# EAGLE design BoardSchematics (EAGLE 9.2.0)

## Sheet 1 of 2: I/O Config
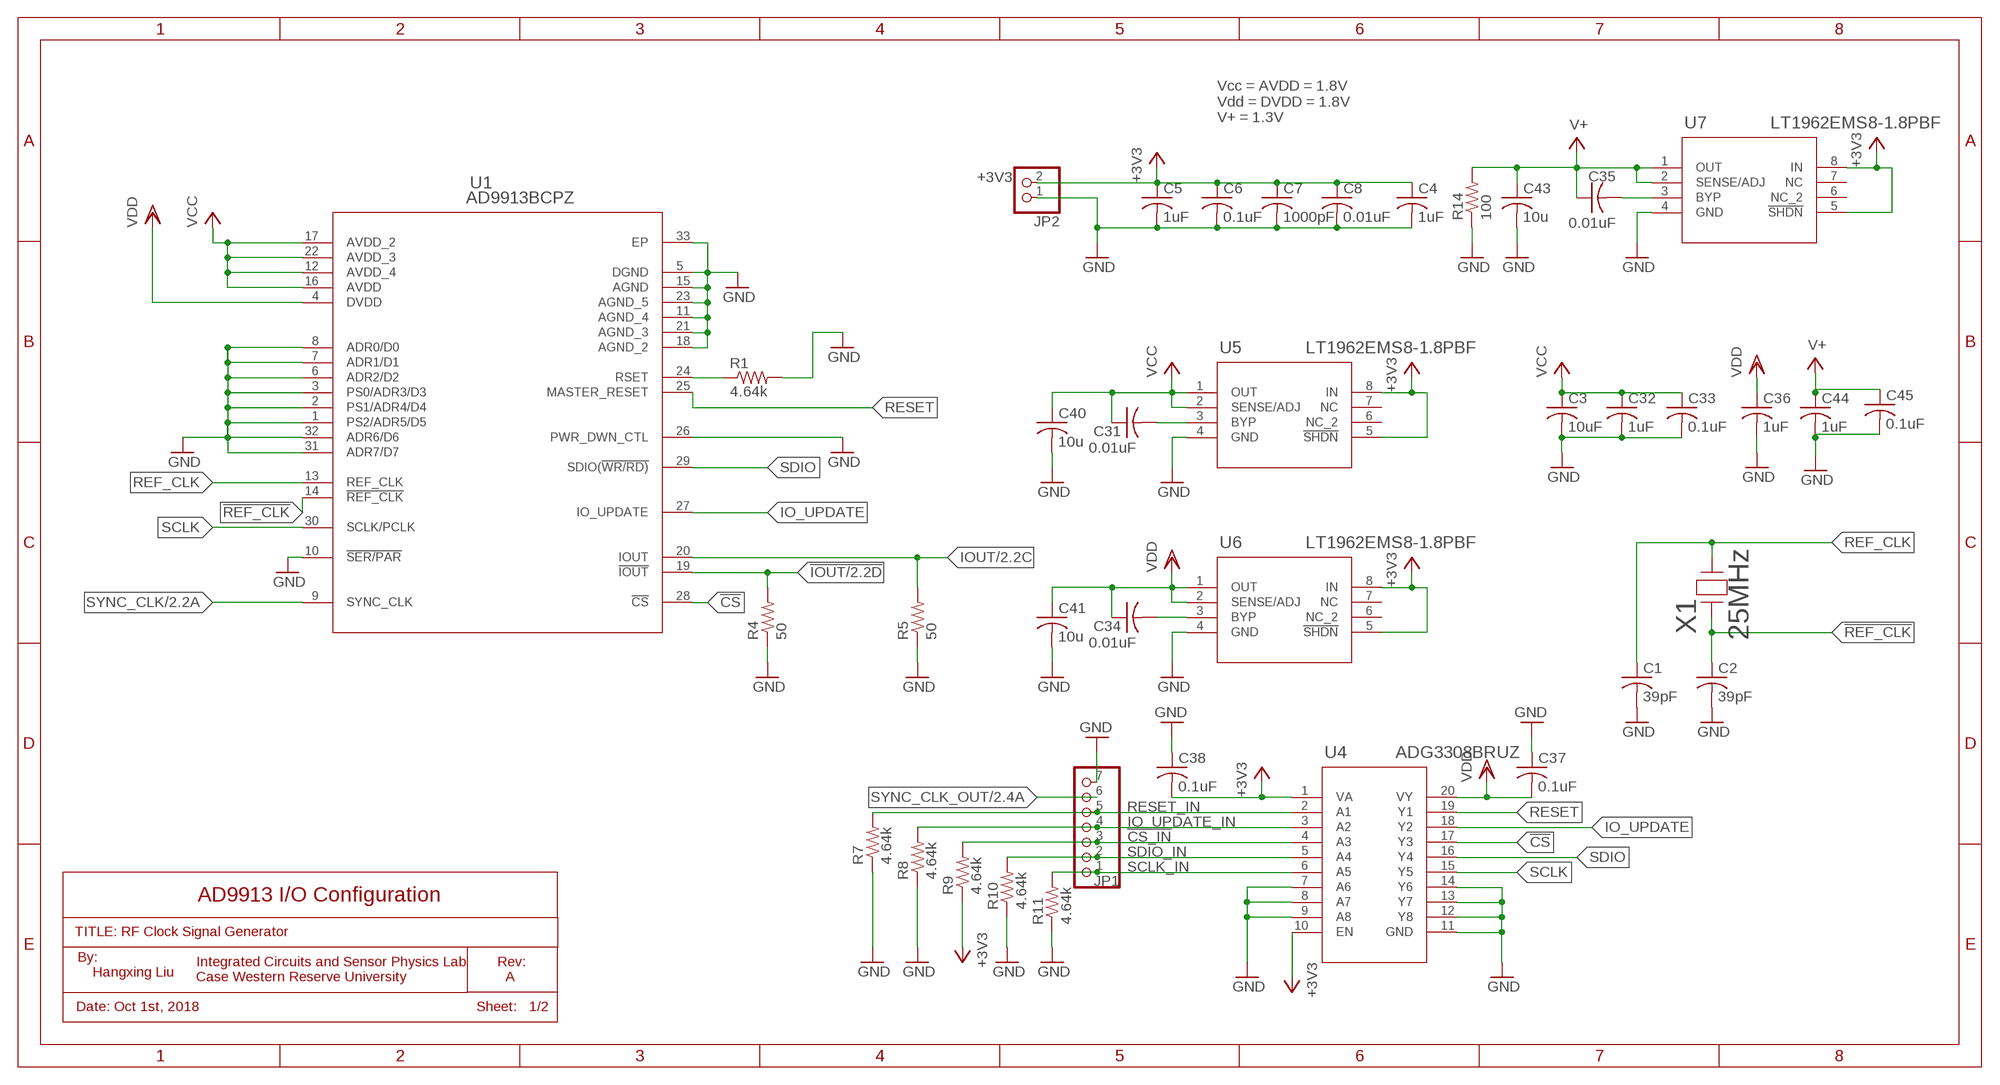
[diagram p0: schematic, sheet 1]

### Parts
C1  39pF  C-USC1608  [C1608]
C2  39pF  C-USC1608  [C1608]
C3  10uF  C-USC0603K  [C0603K]
C4  1uF  C-USC0603K  [C0603K]
C5  1uF  C-USC0603K  [C0603K]
C6  0.1uF  C-USC0603K  [C0603K]
C7  1000pF  C-USC0603K  [C0603K]
C8  0.01uF  C-USC0603K  [C0603K]
C31  0.01uF  C-USC0603K  [C0603K]
C32  1uF  C-USC0603K  [C0603K]
C33  0.1uF  C-USC0603K  [C0603K]
C34  0.01uF  C-USC0603K  [C0603K]
C35  0.01uF  C-USC0603K  [C0603K]
C36  1uF  C-USC0603K  [C0603K]
C37  0.1uF  C-USC0603K  [C0603K]
C38  0.1uF  C-USC0603K  [C0603K]
C40  10u  C-USC0603K  [C0603K]
C41  10u  C-USC0603K  [C0603K]
C43  10u  C-USC0603K  [C0603K]
C44  1uF  C-USC0603K  [C0603K]
C45  0.1uF  C-USC0603K  [C0603K]
JP1  PINHD-1X7  [1X07]
JP2  PINHD-1X2  [1X02]
R1  4.64k  R-US_R0603  [R0603]
R4  50  R-US_R0603  [R0603]
R5  50  R-US_R0603  [R0603]
R7  4.64k  R-US_R0603  [R0603]
R8  4.64k  R-US_R0603  [R0603]
R9  4.64k  R-US_R0603  [R0603]
R10  4.64k  R-US_R0603  [R0603]
R11  4.64k  R-US_R0603  [R0603]
R14  100  R-US_R0603  [R0603]
U1  AD9913BCPZ  [CP_32_2]
U4  ADG3308BRUZ  [RU_20]
U5  LT1962EMS8-1.8PBF  [MSOP-8_MS]
U6  LT1962EMS8-1.8PBF  [MSOP-8_MS]
U7  LT1962EMS8-1.8PBF  [MSOP-8_MS]
X1  25MHz  FOXSDLF/250F-20  [CRYSTAL_HC49SDLF]

### Nets
!CS: U1.28(!CS) U4.17(Y3)
!CS_IN: JP1.3 R9.2 U4.4(A3)
!IOUT: R4.2 U1.19(!IOUT) ; also sheet 2
!REF_CLK: C2.1 U1.14(!REF_CLK) X1.1
+3V3: C4.1 C5.1 C6.1 C7.1 C8.1 C38.2 JP2.2 R9.1 U4.1(VA) U4.10(EN) U5.5(!SHDN) U5.8(IN) U6.5(!SHDN) U6.8(IN) U7.5(!SHDN) U7.8(IN) ; also sheet 2
GND: C1.2 C2.2 C3.2 C4.2 C5.2 C6.2 C7.2 C8.2 C32.2 C33.2 C36.2 C37.1 C38.1 C40.2 C41.2 C43.2 C44.2 C45.2 JP1.7 JP2.1 R1.2 R4.1 R5.1 R7.1 R8.1 R10.1 R11.1 R14.1 U1.1(PS2/ADR5/D5) U1.2(PS1/ADR4/D4) U1.3(PS0/ADR3/D3) U1.5(DGND) U1.6(ADR2/D2) U1.7(ADR1/D1) U1.8(ADR0/D0) U1.10(!SER/PAR) U1.11(AGND_4) U1.15(AGND) U1.18(AGND_2) U1.21(AGND_3) U1.23(AGND_5) U1.26(PWR_DWN_CTL) U1.31(ADR7/D7) U1.32(ADR6/D6) U1.33(EP) U4.7(A6) U4.8(A7) U4.9(A8) U4.11(GND) U4.12(Y8) U4.13(Y7) U4.14(Y6) U5.4(GND) U6.4(GND) U7.4(GND) ; also sheet 2
IO_UPDATE: U1.27(IO_UPDATE) U4.18(Y2)
IO_UPDATE_IN: JP1.4 R8.2 U4.3(A2)
IOUT: R5.2 U1.20(IOUT) ; also sheet 2
N$1: R1.1 U1.24(RSET)
N$4: C31.2 U5.3(BYP)
N$7: C34.2 U6.3(BYP)
N$8: C35.2 U7.3(BYP)
REF_CLK: C1.1 U1.13(REF_CLK) X1.2
RESET: U1.25(MASTER_RESET) U4.19(Y1)
RESET_IN: JP1.5 R7.2 U4.2(A1)
SCLK: U1.30(SCLK/PCLK) U4.15(Y5)
SCLK_IN: JP1.1 R11.2 U4.6(A5)
SDIO: U1.29(SDIO(!WR/RD)) U4.16(Y4)
SDIO_IN: JP1.2 R10.2 U4.5(A4)
SYNC_CLK: U1.9(SYNC_CLK) ; also sheet 2
SYNC_CLK_OUT: JP1.6 ; also sheet 2
V+: C35.1 C43.1 C44.1 C45.1 R14.2 U7.1(OUT) U7.2(SENSE/ADJ) ; also sheet 2
VCC: C3.1 C31.1 C32.1 C33.1 C40.1 U1.12(AVDD_4) U1.16(AVDD) U1.17(AVDD_2) U1.22(AVDD_3) U5.1(OUT) U5.2(SENSE/ADJ)
VDD: C34.1 C36.1 C37.2 C41.1 U1.4(DVDD) U4.20(VY) U6.1(OUT) U6.2(SENSE/ADJ)
Unconnected: U5.6(NC_2) U5.7(NC) U6.6(NC_2) U6.7(NC) U7.6(NC_2) U7.7(NC)

### Notes on the sheet
- Vcc = AVDD = 1.8V
  Vdd = DVDD = 1.8V
  V+ = 1.3V
- AD9913 I/O Configuration
- TITLE: RF Clock Signal Generator
- By:
- Hangxing Liu
- Integrated Circuits and Sensor Physics Lab
  Case Western Reserve University
- Rev:
    A
- Date: Oct 1st, 2018 | Sheet:   1/2

## Sheet 2 of 2: Filter, Buffer and Comparator
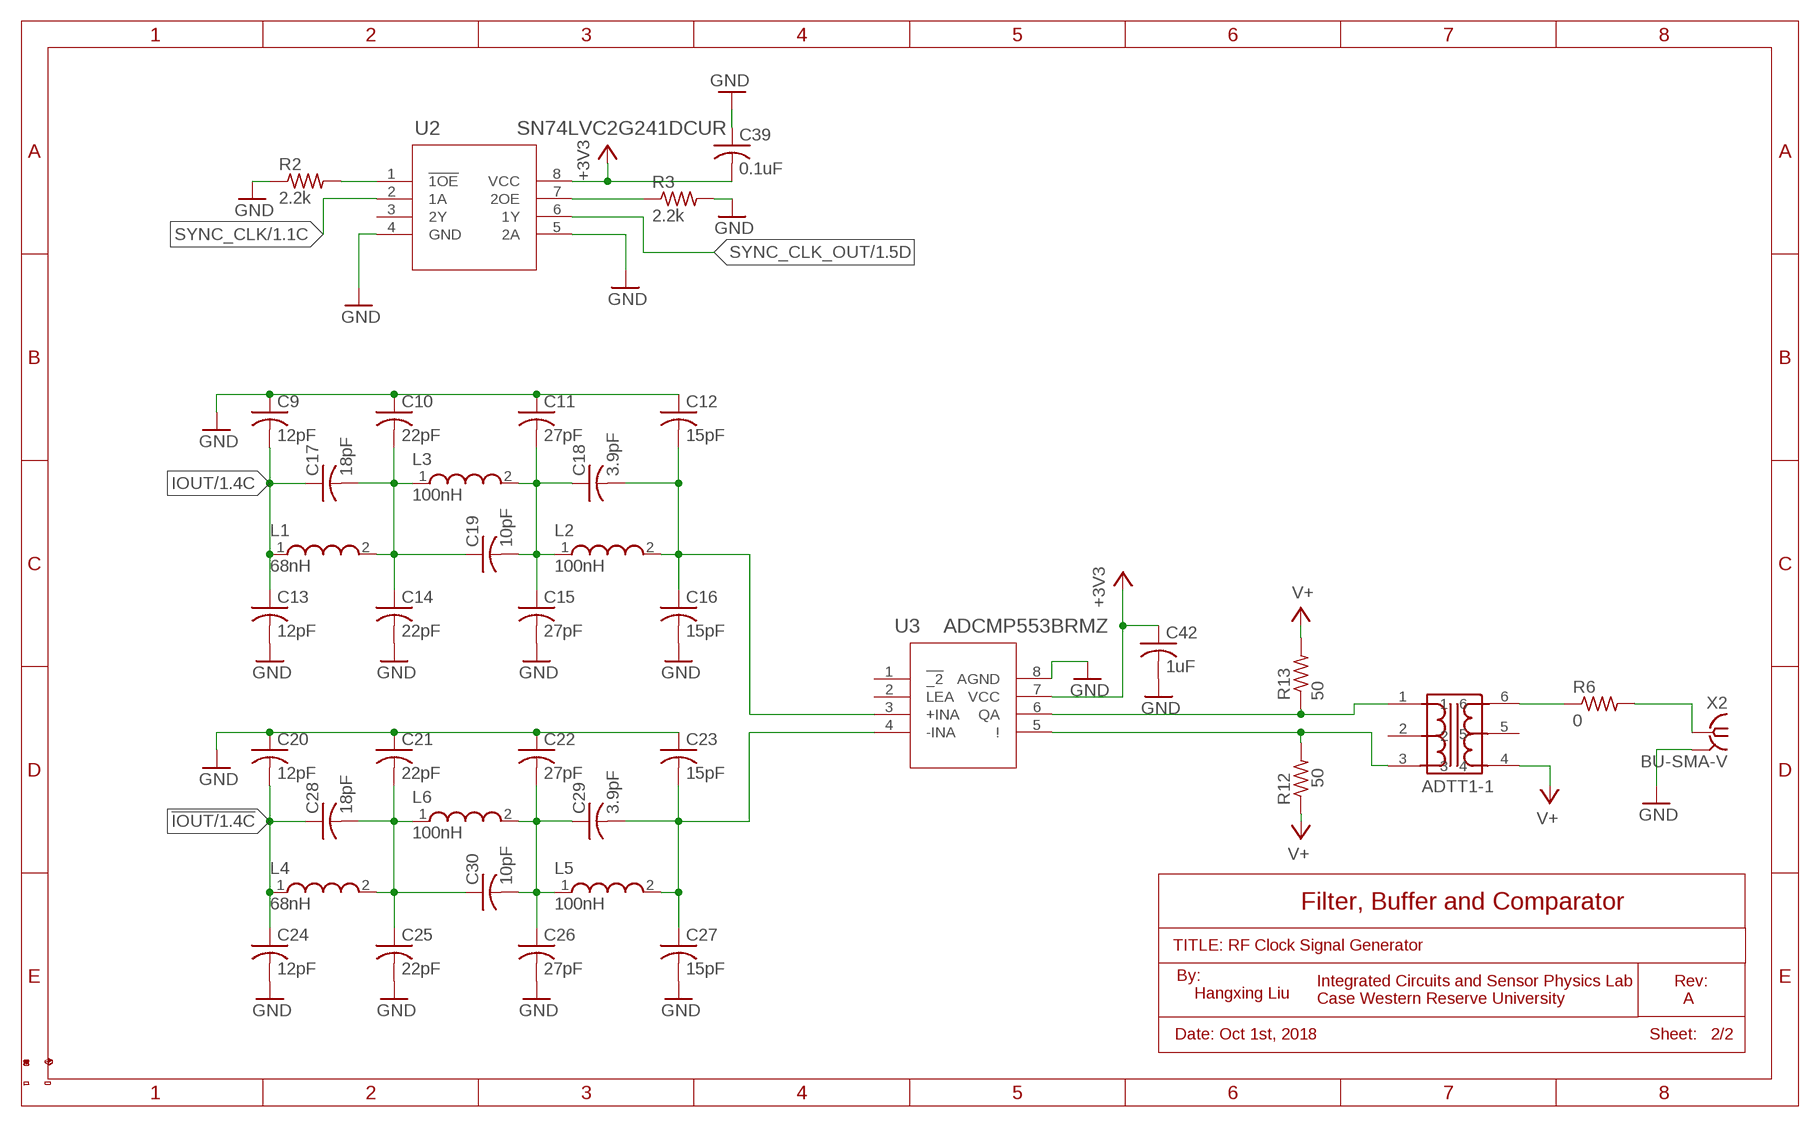
[diagram p1: schematic, sheet 2]

### Parts
ATT1-1  PWB-1-CLCD542  [CD542]
C9  12pF  C-USC0603K  [C0603K]
C10  22pF  C-USC0603K  [C0603K]
C11  27pF  C-USC0603K  [C0603K]
C12  15pF  C-USC0603K  [C0603K]
C13  12pF  C-USC0603K  [C0603K]
C14  22pF  C-USC0603K  [C0603K]
C15  27pF  C-USC0603K  [C0603K]
C16  15pF  C-USC0603K  [C0603K]
C17  18pF  C-USC0603K  [C0603K]
C18  3.9pF  C-USC0603K  [C0603K]
C19  10pF  C-USC0603K  [C0603K]
C20  12pF  C-USC0603K  [C0603K]
C21  22pF  C-USC0603K  [C0603K]
C22  27pF  C-USC0603K  [C0603K]
C23  15pF  C-USC0603K  [C0603K]
C24  12pF  C-USC0603K  [C0603K]
C25  22pF  C-USC0603K  [C0603K]
C26  27pF  C-USC0603K  [C0603K]
C27  15pF  C-USC0603K  [C0603K]
C28  18pF  C-USC0603K  [C0603K]
C29  3.9pF  C-USC0603K  [C0603K]
C30  10pF  C-USC0603K  [C0603K]
C39  0.1uF  C-USC0603K  [C0603K]
C42  1uF  C-USC0603K  [C0603K]
L1  68nH  WE-PMI_1008  [WE-PMI_1008]
L2  100nH  WE-PMI_1008  [WE-PMI_1008]
L3  100nH  WE-PMI_1008  [WE-PMI_1008]
L4  68nH  WE-PMI_1008  [WE-PMI_1008]
L5  100nH  WE-PMI_1008  [WE-PMI_1008]
L6  100nH  WE-PMI_1008  [WE-PMI_1008]
R2  2.2k  R-US_R0603  [R0603]
R3  2.2k  R-US_R0603  [R0603]
R6  0  R-US_R0603  [R0603]
R12  50  R-US_R0603  [R0603]
R13  50  R-US_R0603  [R0603]
U2  SN74LVC2G241DCUR  [DCU8]
U3  ADCMP553BRMZ  [RM_8]
X2  BU-SMA-V  [BU-SMA-V]

### Nets
!IOUT: C20.2 C24.1 C28.1 L4.1 ; also sheet 1
+3V3: C39.2 C42.1 U2.8(VCC) U3.7(VCC) ; also sheet 1
GND: C9.1 C10.1 C11.1 C12.1 C13.2 C14.2 C15.2 C16.2 C20.1 C21.1 C22.1 C23.1 C24.2 C25.2 C26.2 C27.2 C39.1 C42.2 R2.1 R3.2 U2.4(GND) U2.5(2A) U3.8(AGND) X2.2 X2.3 X2.4 X2.5 ; also sheet 1
IOUT: C9.2 C13.1 C17.1 L1.1 ; also sheet 1
N$2: ATT1-1.1 R13.1 U3.6(QA)
N$3: ATT1-1.3 R12.2 U3.5(!)
N$5: ATT1-1.6 R6.1
N$6: R6.2 X2.1
N$9: R2.2 U2.1(!1OE)
N$10: C21.2 C25.1 C28.2 C30.1 L4.2 L6.1
N$11: C10.2 C14.1 C17.2 C19.1 L1.2 L3.1
N$12: R3.1 U2.7(2OE)
N$13: C11.2 C15.1 C18.1 C19.2 L2.1 L3.2
N$14: C12.2 C16.1 C18.2 L2.2 U3.3(+INA)
N$15: C22.2 C26.1 C29.1 C30.2 L5.1 L6.2
N$16: C23.2 C27.1 C29.2 L5.2 U3.4(-INA)
SYNC_CLK: U2.2(1A) ; also sheet 1
SYNC_CLK_OUT: U2.6(1Y) ; also sheet 1
V+: ATT1-1.4 R12.1 R13.2 ; also sheet 1
Unconnected: ATT1-1.2 ATT1-1.5 U2.3(2Y) U3.1(!_2) U3.2(LEA)

### Notes on the sheet
- ADTT1-1
- Filter, Buffer and Comparator
- TITLE: RF Clock Signal Generator
- By:
- Hangxing Liu
- Integrated Circuits and Sensor Physics Lab
  Case Western Reserve University
- Rev:
    A
- Date: Oct 1st, 2018 | Sheet:   2/2

## Library data of the parts
ATT1-1 = untitled:PWB-1-CL
C1-C45 = resistor:C-US: CAPACITOR, American symbol
JP1 = pinhead:PINHD-1X7: PIN HEADER
JP2 = pinhead:PINHD-1X2: PIN HEADER
L1-L6 = Wurth_Elektronik_Passive_rev15c:WE-PMI: Power Multilayer Inductor Characteristics Compact multilayer type Suitable for applications with high currents up to 2.7 A Smallest RDC-Values starting at 40 mΩ Magnetically shielded construction: No crosstalk Operating temperature: –40 °C to +125 °C Available in four sizes and three different types (Low Profile, Low RDC & High Saturation Current) Recommended soldering profile: Reflow Applications DC/DC converters especially at high switching frequencies > 1 MHz Electronic devices with very low profile Portable devices like Smart Phones, Tablets, Notebooks and Digital Cameras <http://katalog.we-online.de/media/images/eisos/IndPMI_pf2.jpgg> Details see: http://katalog.we-online.de/en/pbs/WE-PMI? Updated by Dan Xu 2014-07-08 2014 (C) Wurth Elektronik
R1-R14 = resistor:R-US_: RESISTOR, American symbol
U1 = AD9913Model:AD9913BCPZ; MANUFACTURER_PART_NUMBER: AD9913BCPZ; VENDOR: Analog Devices Inc
U2 = Buffer:SN74LVC2G241DCUR; MANUFACTURER_PART_NUMBER: SN74LVC2G241DCUR; VENDOR: Texas Instruments
U3 = COMP:ADCMP553BRMZ; MANUFACTURER_PART_NUMBER: ADCMP553BRMZ; VENDOR: Analog Devices Inc
U4 = 3308:ADG3308BRUZ; MANUFACTURER_PART_NUMBER: ADG3308BRUZ; VENDOR: Analog Devices Inc
U5-U7 = 1962:LT1962EMS8-1.8PBF; MANUFACTURER_PART_NUMBER: LT1962EMS81.8#PBF; VENDOR: Linear Technology
X1 = OscillatorModel:FOXSDLF/250F-20; MANUFACTURER_PART_NUMBER: FOXSDLF250F20; VENDOR: Fox
X2 = con-coax:BU-SMA-V: FEMALE SMA CONNECTOR Radiall distributor RS 112-3794; OC_FARNELL: unknown; OC_NEWARK: unknown

## Board
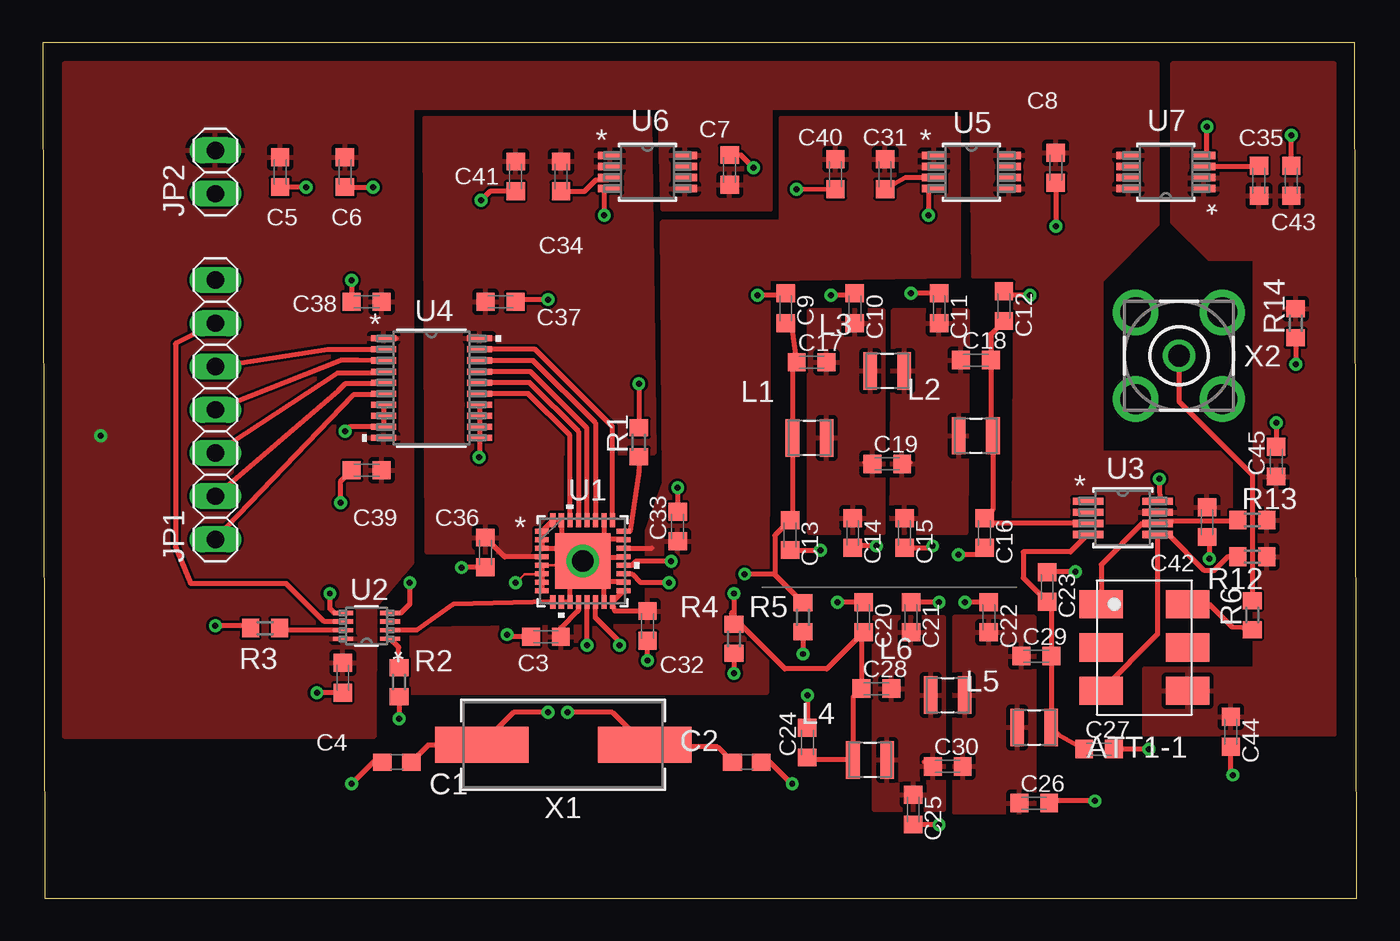
[diagram p2: board, top side]
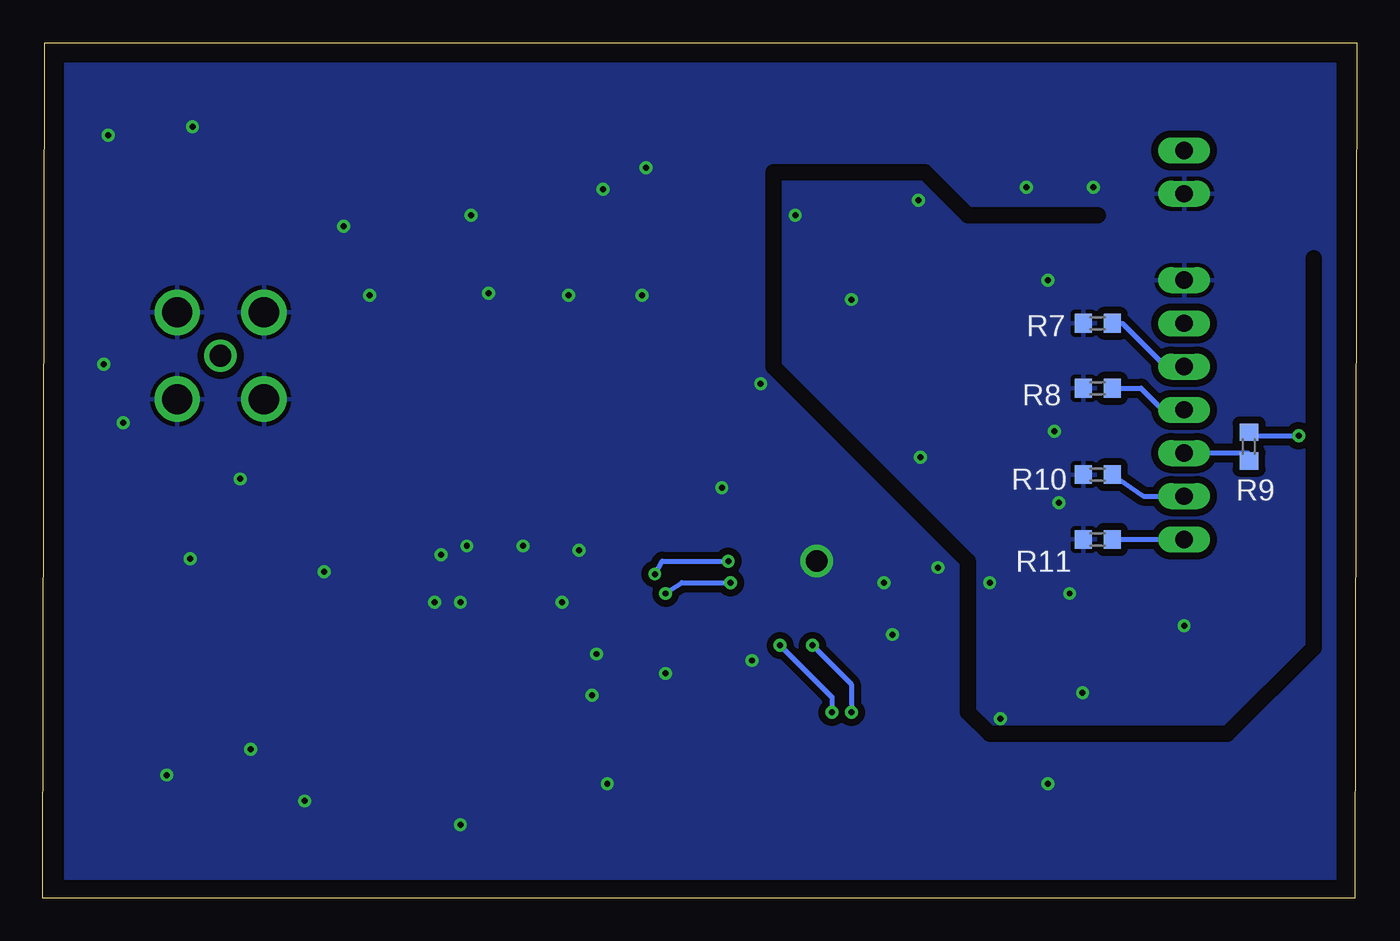
[diagram p3: board, bottom side, seen from below]

Size 77.27 x 50.28 mm. Coordinates in mm from the lower left corner, seen from the top.
Outline: 0.13,0 77.27,0 77.14,50.28 0,50.28 0.13,0
Copper layers (1*16): Top 0.035mm / dielectric 1.5mm / Bottom 0.035mm
Design rules "default": minimum track width 6mil, minimum drill 0.35mm, track to track 6mil, track to pad 6mil, pad to pad 6mil, via to via 6mil, smd to smd 6mil, copper to edge 40mil, drill to drill 6mil, minimum pad ring 10mil, minimum via ring 8mil, stop-mask expansion 4mil, vias tented up to drill 0mil, thermal gap 10mil
bRestrict: 10 lines

### Footprints (pad centres in the part's own frame; a part is rotated, then mirrored left to right if it is on the bottom)
CD542 = smd 1.651 x 2.54: 1 -2.54,-2.54; 2 0,-2.54; 3 2.54,-2.54; 4 2.54,2.54; 5 0,2.54; 6 -2.54,2.54
C1608 = smd 1.1 x 1: 1 -0.85,0; 2 0.85,0
C0603K = smd 1.05 x 1.08: 1 -0.875,0; 2 0.875,0
1X07 = drill 1.016 long: 1 -7.62,0; 2 -5.08,0; 3 -2.54,0; 4 0,0; 5 2.54,0; 6 5.08,0; 7 7.62,0
1X02 = drill 1.016 long: 1 -1.27,0; 2 1.27,0
WE-PMI_1008 = smd 0.8 x 2.2: 1 -1,0; 2 1,0
R0603 = smd 1 x 1.1: 1 -0.85,0; 2 0.85,0
CP_32_2 = smd 0.813 x 0.305: 1 -2.4,1.75; 2 -2.4,1.25; 3 -2.4,0.75; 4 -2.4,0.25; 5 -2.4,-0.25; 6 -2.4,-0.75; 7 -2.4,-1.25; 8 -2.4,-1.75; 17 2.4,-1.75; 18 2.4,-1.25; 19 2.4,-0.75; 20 2.4,-0.25; 21 2.4,0.25; 22 2.4,0.75; 23 2.4,1.25; 24 2.4,1.75 | smd 0.305 x 0.813: 9 -1.75,-2.4; 10 -1.25,-2.4; 11 -0.75,-2.4; 12 -0.25,-2.4; 13 0.25,-2.4; 14 0.75,-2.4; 15 1.25,-2.4; 16 1.75,-2.4; 25 1.75,2.4; 26 1.25,2.4; 27 0.75,2.4; 28 0.25,2.4; 29 -0.25,2.4; 30 -0.75,2.4; 31 -1.25,2.4; 32 -1.75,2.4 | smd 3.251 x 3.251: 33 0,0
DCU8 = smd 1.168 x 0.254: 1 -1.372,0.75; 2 -1.372,0.25; 3 -1.372,-0.25; 4 -1.372,-0.75; 5 1.372,-0.75; 6 1.372,-0.25; 7 1.372,0.25; 8 1.372,0.75
RM_8 = smd 1.778 x 0.432: 1 -2.045,0.975; 2 -2.045,0.325; 3 -2.045,-0.325; 4 -2.045,-0.975; 5 2.045,-0.975; 6 2.045,-0.325; 7 2.045,0.325; 8 2.045,0.975
RU_20 = smd 1.473 x 0.356: 1 -2.819,2.925; 2 -2.819,2.275; 3 -2.819,1.625; 4 -2.819,0.975; 5 -2.819,0.325; 6 -2.819,-0.325; 7 -2.819,-0.975; 8 -2.819,-1.625; 9 -2.819,-2.275; 10 -2.819,-2.925; 11 2.819,-2.925; 12 2.819,-2.275; 13 2.819,-1.625; 14 2.819,-0.975; 15 2.819,-0.325; 16 2.819,0.325; 17 2.819,0.975; 18 2.819,1.625; 19 2.819,2.275; 20 2.819,2.925
MSOP-8_MS = smd 1.397 x 0.432: 1 -2.21,0.975; 2 -2.21,0.325; 3 -2.21,-0.325; 4 -2.21,-0.975; 5 2.21,-0.975; 6 2.21,-0.325; 7 2.21,0.325; 8 2.21,0.975
CRYSTAL_HC49SDLF = smd 5.499 x 2.108: 1 -4.794,0; 2 4.794,0
BU-SMA-V = drill 1.27: 1 0,0 | drill 1.778: 2 -2.55,2.55; 3 2.55,2.55; 4 2.55,-2.55; 5 -2.55,-2.55

### Placement (x,y rotation side)
ATT1-1  64.77,14.73 270 top
C1  20.83,8 180 top
C2  41.4,8 0 top
C3  29.59,15.37 180 top
C4  17.65,12.95 270 top
C5  13.97,42.67 270 top
C6  17.78,42.67 270 top
C7  40.39,42.8 90 top
C8  59.56,42.93 270 top
C9  43.69,34.67 270 top
C10  47.75,34.67 270 top
C11  52.7,34.67 270 top
C12  56.52,34.8 270 top
C13  43.94,21.34 270 top
C14  47.62,21.46 270 top
C15  50.67,21.46 270 top
C16  55.37,21.46 270 top
C17  45.21,31.5 0 top
C18  54.86,31.62 0 top
C19  49.66,25.53 0 top
C20  48.26,16.51 270 top
C21  51.05,16.51 270 top
C22  55.63,16.51 270 top
C23  59.05,18.29 270 top
C24  44.96,9.14 90 top
C25  51.18,5.21 270 top
C26  58.29,5.59 0 top
C27  62.1,8.76 0 top
C28  49.02,12.32 0 top
C29  58.42,14.22 0 top
C30  53.21,7.75 0 top
C31  49.53,42.55 270 top
C32  35.56,16 270 top
C33  37.34,21.84 90 top
C34  30.48,42.42 270 top
C35  71.5,42.16 90 top
C36  26.03,20.32 270 top
C37  26.92,35.05 180 top
C38  19.05,35.05 0 top
C39  19.05,25.15 0 top
C40  46.61,42.55 270 top
C41  27.81,42.42 270 top
C42  68.45,22.1 270 top
C43  73.41,42.16 90 top
C44  69.85,9.78 270 top
C45  72.52,25.65 90 top
JP1  10.16,28.7 90 top
JP2  10.16,42.67 90 top
L1  45.09,27.05 0 top
L2  54.86,27.18 0 top
L3  49.66,30.99 0 top
L4  48.64,8.13 0 top
L5  58.29,10.03 0 top
L6  53.21,11.94 0 top
R1  35.05,26.8 90 top
R2  20.95,12.7 90 top
R3  13.08,15.88 180 top
R4  40.64,15.24 90 top
R5  44.7,16.51 90 top
R6  71.12,16.64 90 top
R7  15.24,33.78 0 bottom
R8  15.24,29.97 0 bottom
R9  6.35,26.54 270 bottom
R10  15.24,24.89 0 bottom
R11  15.24,21.08 0 bottom
R12  71.12,20.07 180 top
R13  71.12,22.23 0 top
R14  73.66,33.78 90 top
U1  31.75,19.81 0 top
U2  19.05,16 180 top
U3  63.5,22.35 0 top
U4  22.86,29.97 0 top
U5  54.61,42.67 0 top
U6  35.56,42.67 0 top
U7  66.04,42.67 180 top
X1  30.61,9.02 180 top
X2  66.8,31.88 0 top

### Tracks (layer width: path | path; a pad name or v marks a point on that pad's centre or on a via)
!CS
  Top 0.305: U1.28 32,27.62 28.68,30.95 U4.17
!CS_IN
  Top 0.305: JP1.3 17.33,30.86 19.95,30.86 U4.4
  Bottom 0.305: JP1.3 6.39,26.16 R9.2
!IOUT  (via drill 0.35)
  Top 0.305: R4.2 40.5,16.78 | v40.64,17.91 R4.2 | v36.83,18.54 35.16,18.54 34.64,19.06 U1.19 | C24.1 45.1,8.13 L4.1 47.64,11.81 C28.1 48.15,15.63 C20.2 46.1,13.48 43.63,13.48 41.02,16.09 R4.2
  Bottom 0.305: v40.64,17.91 39.69,18.54 v36.83,18.54
!REF_CLK  (via drill 0.35)
  Top 0.305: v33.91,14.86 33.91,15.06 32.5,16.47 U1.14 | v30.86,10.92 33.5,10.92 X1.1 36.67,9.02 36.8,8.89 39.66,8.89 C2.1
  Bottom 0.305: v33.91,14.86 30.86,11.81 v30.86,10.92
+3V3  (via drill 0.35)
  Top 0.305: 20.8,32.9 U4.1 | U5.8 | U5.5 56.86,41.7
  Bottom 0.305: R9.1 6.13,27.18 v3.43,27.18
  pour Top: 1.27,49.02 1.27,9.52 19.51,9.52 19.56,17.15 21.72,19.72 21.72,46.48 36.32,46.48 36.32,44.7 36.45,40.51 42.8,40.51 42.8,46.48 54.61,46.48 54.71,36.58 57.2,36.58 57.1,22.14 65.53,22.14 69.85,22.1 69.85,26.16 62.23,26.16 62.23,36.32 65.53,39.62 65.53,49.02
GND  (via drill 0.35, 1.27 pad 1.78)
  Top 0.152: U1.6 29.34,19.05 28.32,19.05 v27.81,18.54 | U1.5 31.5,19.56
  Top 0.305: U1.1 U1.2 | U1.1 U1.3 | v65.02,8.76 C27.2 | v61.85,5.72 59.3,5.72 C26.2 | v52.7,4.32 51.2,4.32 C25.2 | v44.96,11.94 C24.2 | v60.71,19.18 59.07,19.18 C23.1 | C22.1 54.24,17.38 v54.23,17.4 | v52.7,17.4 51.07,17.4 C21.1 | C20.1 46.75,17.38 v46.74,17.4 | C16.2 54.98,20.19 v53.85,20.19 | v52.32,20.7 52.21,20.59 C15.2 | v49.02,20.7 47.74,20.7 C14.2 | v45.72,20.45 45.71,20.46 C13.2 | v58.04,35.43 56.75,35.43 C12.1 | C11.1 52.69,35.56 v51.05,35.56 | C10.1 47.64,35.43 v46.35,35.43 | C9.1 43.58,35.43 v42.04,35.43 | R2.1 v20.95,10.54 | v33.02,40.13 33.02,41.7 U6.4 | v52.07,40.13 52.07,41.7 U5.4 | U2.4 21.06,16.75 21.59,17.28 v21.59,18.54 | U2.5 17.17,16.75 16.89,17.03 v16.89,17.91 | R4.1 v40.64,13.21 | R5.1 v44.7,14.35 | U1.1 U1.32 U1.31 30.5,21.06 U1.33 | v17.78,27.43 18.04,27.7 U4.9 U4.8 U4.7 | U4.14 U4.13 U4.12 U4.11 25.68,25.93 v25.65,25.91 | U1.33 | U1.5 U1.6 U1.7 U1.8 | 32,20.06 U1.33 | 29.39,20.52 U1.3 | v41.78,42.93 41.03,43.67 C7.2 | C8.2 v59.56,39.5 | v18.16,36.32 18.16,35.07 C38.1 | U1.3 31,20.56 U1.33 | 31.5,19.56 U1.33 | U1.10 U1.11 31,19.06 U1.33 | U1.18 34.11,18.6 33.02,18.6 | 33.02,18.6 32.35,18.6 31.75,19.2 U1.33 | U1.15 33.02,17.43 33.02,18.6 | U1.21 34.11,20.02 33.11,20.02 33.02,19.93 | 33.02,19.93 33.02,18.6 | U1.26 33.02,22.19 33.02,21.08 | 33.02,21.08 33.02,19.93 | U1.23 34.13,21.08 33.02,21.08 | C42.2 68.45,20.95 68.58,20.83 v68.58,19.94 | v65.66,24.64 65.69,23.48 U3.8 | v35.05,30.23 R1.2 | v17.53,23.24 17.53,24.51 C39.1 | R3.2 12.23,16 v10.16,16 | v37.34,24.13 C33.2 | v35.56,13.97 C32.2 | C3.2 27.43,15.37 v27.3,15.49 | C36.2 24.7,19.45 v24.64,19.43 | v29.72,35.18 27.93,35.18 C37.1 | C4.2 16.15,12.08 v16.13,12.06 | C40.2 46.59,41.65 v44.32,41.66
  Top 0.305: C5.2 15.48,41.8 v15.49,41.78 | C6.2 17.79,41.78 v19.43,41.78 | C41.2 26.3,41.54 v25.78,41.02 | C43.2 v73.41,44.83 | U7.4 68.45,43.85 v68.45,45.34 | C1.2 19.43,8 v18.16,6.73 | v44.07,6.73 44.03,6.73 42.76,8 C2.2 | v69.98,7.24 69.85,7.42 C44.2 | v72.52,27.94 C45.2 | R14.1 v73.66,31.37
  other vias: 31.75,19.81
  pour Bottom (isolate 0.406): 1.27,49.02 1.27,1.14 75.95,1.14 75.95,49.02
IO_UPDATE
  Top 0.305: U1.27 32.5,27.94 28.84,31.6 U4.18
IO_UPDATE_IN
  Top 0.305: JP1.4 17.53,31.62 18.54,31.62 19.84,31.6 U4.3
  Bottom 0.305: R8.2 12.7,29.97 11.43,28.7 JP1.4
IOUT  (via drill 0.35)
  Top 0.305: C9.2 44.07,33.41 C17.1 44.09,31.24 L1.1 44.09,22.69 C13.1 43.05,21.32 43.05,19.01 R5.2 43.01,19.05 v41.27,19.05 | v36.96,19.81 34.89,19.81 34.64,19.56 U1.20
  Bottom 0.305: v36.96,19.81 40.85,19.81 v41.27,19.05
N$1
  Top 0.305: U1.24 34.53,21.56 35.05,25.13 R1.1
N$2
  Top 0.305: ATT1-1.1 62.23,19.6 64.66,22.02 U3.6 65.66,22.14 70.19,22.14 R13.1
N$3
  Top 0.305: ATT1-1.3 65.55,15.51 U3.5 66.18,21.38 68.3,19.26 68.86,19.26 69.67,20.07 R12.2
N$4
  Top 0.305: U5.3 50.73,42.35 C31.2
N$5
  Top 0.305: R6.1 71.04,15.86 69.93,15.93 68.58,17.27 ATT1-1.6
N$6
  Top 0.305: R6.2 71.12,24.89 66.8,29.21 X2.1
N$7
  Top 0.305: U6.3 33.22,42.22 32.52,42.22 31.85,41.54 C34.2
N$8
  Top 0.305: C35.2 71.46,43 U7.3
N$9
  Top 0.305: R2.2 20.94,14.74 U2.1
N$10
  Top 0.305: C30.1 51.81,8.01 | 50.02,11.92 C28.2 | 49.64,8.53 L4.2
  pour Top: 48.89,16.51 52.96,16.51 52.96,5.21 48.89,5.21
N$11
  Top 0.305: 48.32,25.59 C19.1 48.66,25.93 | 46.21,31.1 C17.2 | 46.23,27.19 L1.2
  pour Top: 45.09,34.54 49.4,34.54 49.4,21.46 45.09,21.46
N$12
  Top 0.305: U2.7 14.32,15.75 R3.1
N$13
  Top 0.305: 50.99,25.59 C19.2 50.66,25.93 | 53.86,27.2 L2.1 | C18.1 53.86,31.22
  pour Top: 50.03,34.54 54.36,34.54 54.27,21.46 49.93,21.46
N$14
  Top 0.305: C12.2 55.74,33.15 C18.2 55.74,27.3 L2.2 55.86,22.83 C16.1 55.68,22.03 U3.3
N$15
  Top 0.305: 57.15,14.09 C29.1 57.42,13.82
  pour Top: 53.59,16.51 53.59,5.08 58.29,5.08 58.29,16.51
N$16
  Top 0.305: U3.4 60.43,20.35 57.64,20.35 57.64,18.82 C23.2 59.3,17.17 C29.2 L5.2 59.69,9.64 C27.1
REF_CLK  (via drill 0.35)
  Top 0.305: C1.1 22.69,9.02 X1.2 27.7,10.92 v29.72,10.92 | v32,14.86 U1.13
  Bottom 0.305: v29.72,10.92 29.72,12.57 v32,14.86
RESET
  Top 0.305: U1.25 33.5,27.71 28.96,32.26 25.69,32.26 U4.19
RESET_IN
  Top 0.305: JP1.5 16.76,32.26 16.77,32.25 U4.2
  Bottom 0.305: R7.2 13.78,33.78 11.24,31.24 JP1.5
SCLK
  Top 0.305: U1.30 31,27.2 28.55,29.65 U4.15
SCLK_IN
  Top 0.305: JP1.1 18.29,29.59 19.98,29.59 U4.6
  Bottom 0.305: R11.2 JP1.1
SDIO
  Top 0.305: U1.29 31.5,27.43 28.63,30.3 U4.16
SDIO_IN
  Top 0.305: JP1.2 17.4,29.84 17.78,30.23 19.97,30.23 U4.5
  Bottom 0.305: R10.2 12.57,23.62 JP1.2
SYNC_CLK
  Top 0.305: U1.9 24.13,17.27 21.99,15.75 U2.2
SYNC_CLK_OUT
  Top 0.305: U2.6 16.56,16.25 14.32,18.49 8.73,18.49 7.82,20.67 7.82,32.57 7.89,32.64 JP1.6
V+
  pour Top: 66.42,49.02 66.42,39.75 68.58,37.59 71.25,37.59 71.25,13.46 64.77,13.46 64.77,9.65 75.95,9.65 75.95,49.02
VCC
  Top 0.305: C32.1 33.65,16.88 33.53,17.26 33.5,17.34 U1.16 U1.17 | U1.22 35.81,20.57 | U1.12 31.5,16.9 31.46,16.86 31.46,16.88 30.47,15.89 C3.1
  pour Top: 43.43,45.85 53.85,45.85 53.85,36.55 42.64,36.36 42.64,32.76 42.54,12.06 21.72,12.06 21.72,15.85 35.56,16 35.56,21.59 36.58,24.38 36.45,39.75 43.43,39.75
VDD
  Top 0.305: U4.20 25.59,32.98 25.07,32.98 | U1.4 27.17,20.06 C36.1
  pour Top: 22.48,45.85 35.69,45.85 35.94,26.16 30.48,26.16 30.48,20.32 22.61,20.32

### Text on the board
Document: 3V3 | GND | GND | SYNC_CLK | RESET | IO_UPDATE | !CS | SDIO | SCLK
bDocu: Clock Signal Generator (Rev C) / By Hangxing Liu / Integrated Circuits and Sensor Physics Lab / Case Western Reserve University / Jan 2019